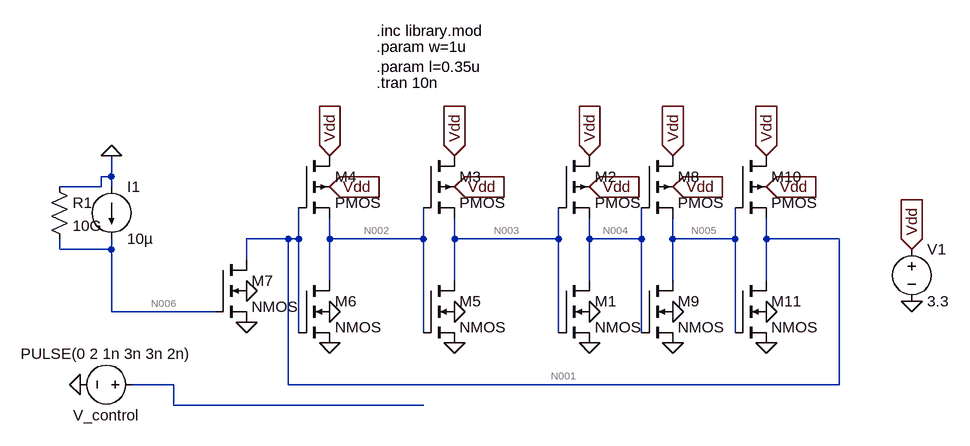
[diagram p0: schematic quiz5.asc]
quiz5.asc, the LTspice schematic file:
Version 4
SHEET 1 880 680
WIRE -736 -80 -736 -112
WIRE -736 -80 -752 -80
WIRE -752 -64 -752 -80
WIRE -752 -64 -816 -64
WIRE -736 -64 -736 -80
WIRE -464 16 -528 16
WIRE -448 16 -448 -32
WIRE -448 16 -464 16
WIRE -400 16 -400 -16
WIRE -256 16 -256 -32
WIRE -256 16 -400 16
WIRE -208 16 -208 -16
WIRE -48 16 -48 -32
WIRE -48 16 -208 16
WIRE 0 16 0 -16
WIRE 80 16 80 -32
WIRE 80 16 0 16
WIRE 128 16 128 -16
WIRE 224 16 224 -32
WIRE 224 16 128 16
WIRE 272 16 272 -16
WIRE 384 16 272 16
WIRE -816 32 -816 16
WIRE -736 32 -736 16
WIRE -736 32 -816 32
WIRE -528 48 -528 16
WIRE -400 80 -400 16
WIRE -208 80 -208 16
WIRE 0 80 0 16
WIRE 128 80 128 16
WIRE 272 80 272 16
WIRE -736 128 -736 32
WIRE -576 128 -736 128
WIRE -448 160 -448 16
WIRE -256 160 -256 16
WIRE -48 160 -48 16
WIRE 80 160 80 16
WIRE 224 160 224 16
WIRE -640 240 -704 240
WIRE -464 240 -464 16
WIRE 384 240 384 16
WIRE 384 240 -464 240
WIRE -640 272 -640 240
WIRE -256 272 -640 272
FLAG 496 112 0
FLAG 496 32 Vdd
IOPIN 496 32 In
FLAG 0 128 0
FLAG 0 -112 Vdd
IOPIN 0 -112 In
FLAG 0 -64 Vdd
IOPIN 0 -64 In
FLAG -208 128 0
FLAG -208 -112 Vdd
IOPIN -208 -112 In
FLAG -208 -64 Vdd
IOPIN -208 -64 In
FLAG -400 128 0
FLAG -400 -112 Vdd
IOPIN -400 -112 In
FLAG -400 -64 Vdd
IOPIN -400 -64 In
FLAG -528 96 0
FLAG -784 240 0
FLAG -528 144 0
FLAG 0 176 0
FLAG -400 176 0
FLAG -208 176 0
FLAG 128 128 0
FLAG 128 -112 Vdd
IOPIN 128 -112 In
FLAG 128 -64 Vdd
IOPIN 128 -64 In
FLAG 128 176 0
FLAG -736 -112 0
FLAG 272 128 0
FLAG 272 -112 Vdd
IOPIN 272 -112 In
FLAG 272 -64 Vdd
IOPIN 272 -64 In
FLAG 272 176 0
SYMBOL voltage 496 16 R0
WINDOW 123 0 0 Left 0
WINDOW 39 0 0 Left 0
SYMATTR InstName V1
SYMATTR Value 3.3
SYMBOL pmos4 -48 -112 R0
SYMATTR InstName M2
SYMATTR Value2 l=l w=w
SYMBOL nmos4 -48 80 R0
SYMATTR InstName M1
SYMATTR Value2 l=l w=w
SYMBOL pmos4 -256 -112 R0
SYMATTR InstName M3
SYMATTR Value2 l=l w=w
SYMBOL nmos4 -256 80 R0
SYMATTR InstName M5
SYMATTR Value2 l=l w=w
SYMBOL pmos4 -448 -112 R0
SYMATTR InstName M4
SYMATTR Value2 l=l w=w
SYMBOL nmos4 -448 80 R0
SYMATTR InstName M6
SYMATTR Value2 l=l w=w
SYMBOL nmos4 -576 48 R0
SYMATTR InstName M7
SYMATTR Value2 l=1u w=0.7u
SYMBOL voltage -688 240 R90
WINDOW 0 32 56 VTop 2
WINDOW 3 -32 56 VBottom 2
WINDOW 123 0 0 Left 0
WINDOW 39 0 0 Left 0
SYMATTR InstName V_control
SYMATTR Value PULSE(0 2 1n 3n 3n 2n)
SYMBOL pmos4 80 -112 R0
SYMATTR InstName M8
SYMATTR Value2 l=l w=w
SYMBOL nmos4 80 80 R0
SYMATTR InstName M9
SYMATTR Value2 l=l w=w
SYMBOL current -736 -64 R0
SYMATTR InstName I1
SYMATTR Value 10µ
SYMBOL res -832 -80 R0
SYMATTR InstName R1
SYMATTR Value 10G
SYMBOL pmos4 224 -112 R0
SYMATTR InstName M10
SYMATTR Value2 l=l w=w
SYMBOL nmos4 224 80 R0
SYMATTR InstName M11
SYMATTR Value2 l=l w=w
TEXT -328 -280 Left 2 !.param w=1u\n.param l=0.35u
TEXT -328 -224 Left 2 !.tran 10n
TEXT -328 -304 Left 2 !.inc library.mod

The netlist it stands for:
* quiz5.asc
V1 Vdd 0 3.3
M2 Vdd N003 N004 Vdd PMOS l=l w=w
M1 N004 N003 0 0 NMOS l=l w=w
M3 Vdd N002 N003 Vdd PMOS l=l w=w
M5 N003 N002 0 0 NMOS l=l w=w
M4 Vdd N001 N002 Vdd PMOS l=l w=w
M6 N002 N001 0 0 NMOS l=l w=w
M7 N001 N006 0 0 NMOS l=1u w=0.7u
V_control N007 0 PULSE(0 2 1n 3n 3n 2n)
M8 Vdd N004 N005 Vdd PMOS l=l w=w
M9 N005 N004 0 0 NMOS l=l w=w
I1 0 N006 10µ
R1 0 N006 10G
M10 Vdd N005 N001 Vdd PMOS l=l w=w
M11 N001 N005 0 0 NMOS l=l w=w
.model NMOS NMOS
.model PMOS PMOS
.lib standard.mos
.param w=1u
.param l=0.35u
.tran 10n
.inc library.mod
.backanno
.end

* Results of the author's LTspice run, read from the files saved beside the schematic
* Operating Point, zero values left out:
*   V(vdd) = 3.3 V
*   V(n003) = 1.282 V
*   V(n004) = 1.282 V
*   V(n002) = 1.282 V
*   V(n001) = 1.282 V
*   V(n006) = 100 kV
*   V(n005) = 1.282 V
*   Id(M2) = 71.14 µA
*   Ib(M2) = 2.028 pA
*   Is(M2) = -71.14 µA
*   Id(M3) = 71.14 µA
*   Ib(M3) = 2.028 pA
*   Is(M3) = -71.14 µA
*   Id(M4) = 71.14 µA
*   Ib(M4) = 2.028 pA
*   Is(M4) = -71.14 µA
*   Id(M8) = 71.14 µA
*   Ib(M8) = 2.028 pA
*   Is(M8) = -71.14 µA
*   Id(M10) = 71.16 µA
*   Ib(M10) = 2.028 pA
*   Is(M10) = -71.16 µA
*   Id(M1) = 71.14 µA
*   Ib(M1) = -1.292 pA
*   Is(M1) = -71.14 µA
*   Id(M5) = 71.14 µA
*   Ib(M5) = -1.292 pA
*   Is(M5) = -71.14 µA
*   Id(M6) = 71.14 µA
*   Ib(M6) = -1.292 pA
*   Is(M6) = -71.14 µA
*   Id(M7) = 39.09 nA
*   Ib(M7) = -1.292 pA
*   Is(M7) = -39.09 nA
*   Id(M9) = 71.14 µA
*   Ib(M9) = -1.292 pA
*   Is(M9) = -71.14 µA
*   Id(M11) = 71.12 µA
*   Ib(M11) = -1.292 pA
*   Is(M11) = -71.12 µA
*   I(I1) = 10 µA
*   I(R1) = -10 µA
*   I(V1) = -355.7 µA
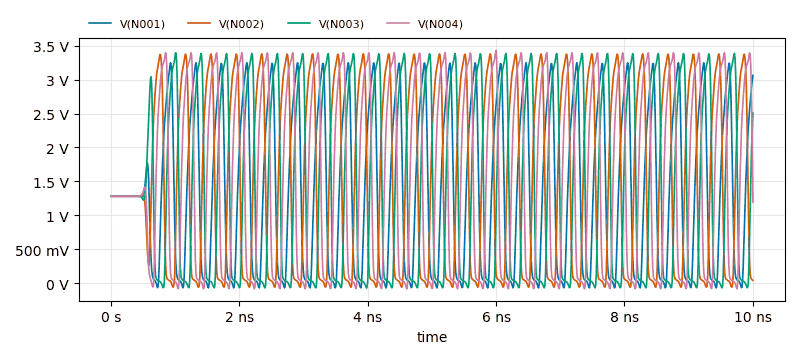
[diagram p1: Transient Analysis of quiz5.asc, plotted from the saved traces]
* Transient Analysis, 1 run:
*   V(N001): min -67.59 mV, max 3.247 V, average 1.396 V, rms 1.836 V, last 3.061 V
*   V(N002): min -57.13 mV, max 3.377 V, average 1.517 V, rms 2.007 V, last 44.65 mV
*   V(N003): min -69.31 mV, max 3.394 V, average 1.431 V, rms 1.948 V, last 2.506 V
*   V(N004): min -79.91 mV, max 3.43 V, average 1.53 V, rms 2.033 V, last 1.195 V